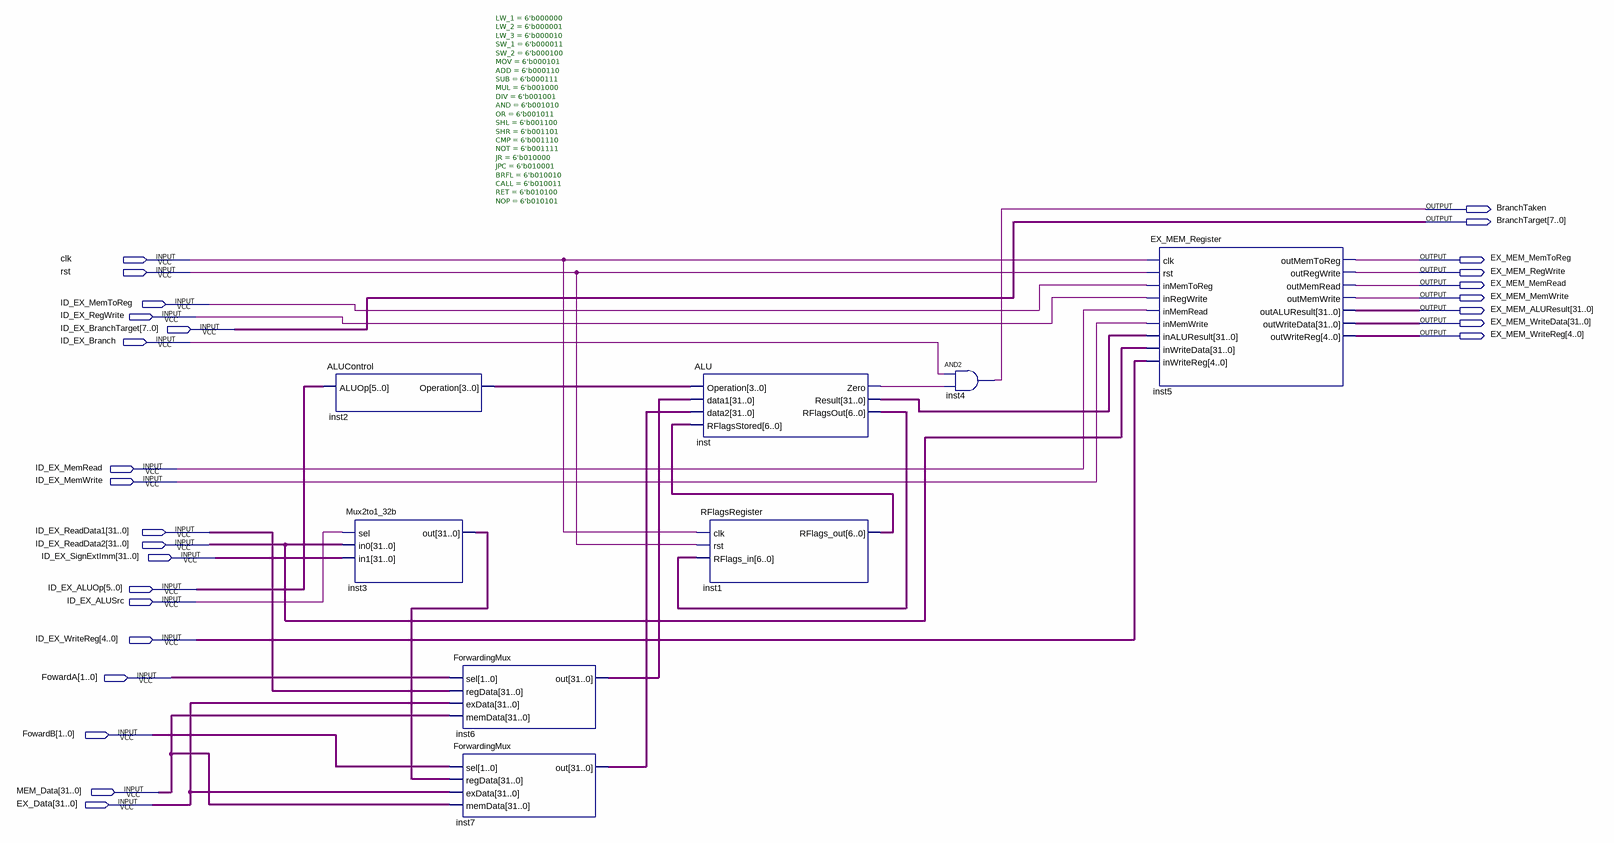
[diagram p0: schematic sheet]
// Quartus schematic EX_STAGE.bdf as structural Verilog: 8 symbols, 27 pins
module EX_STAGE (
  input  clk,
  input  rst,
  input  ID_EX_MemToReg,
  input  ID_EX_RegWrite,
  input  [7:0] ID_EX_BranchTarget,
  input  ID_EX_Branch,
  input  ID_EX_MemRead,
  input  ID_EX_MemWrite,
  input  [31:0] ID_EX_ReadData1,
  input  [31:0] ID_EX_ReadData2,
  input  [31:0] ID_EX_SignExtImm,
  input  [5:0] ID_EX_ALUOp,
  input  ID_EX_ALUSrc,
  input  [4:0] ID_EX_WriteReg,
  input  [1:0] FowardA,
  input  [1:0] FowardB,
  input  [31:0] MEM_Data,
  input  [31:0] EX_Data,
  output BranchTaken,
  output [7:0] BranchTarget,
  output EX_MEM_MemToReg,
  output EX_MEM_RegWrite,
  output EX_MEM_MemRead,
  output EX_MEM_MemWrite,
  output [31:0] EX_MEM_ALUResult,
  output [31:0] EX_MEM_WriteData,
  output [4:0] EX_MEM_WriteReg
);

  wire inst_zero;
  wire [3:0] inst2_operation;
  wire [6:0] inst1_rflags_out, inst_rflagsout;
  wire [31:0] inst3_out, inst6_out, inst7_out, inst_result;

  ALUControl #(.LW_1(6'b000000), .LW_2(6'b000001), .LW_3(6'b000010), .SW_1(6'b000011), .SW_2(6'b000100), .MOV(6'b000101), .ADD(6'b000110), .SUB(6'b000111), .MUL(6'b001000), .DIV(6'b001001), .AND(6'b001010), .OR(6'b001011), .SHL(6'b001100), .SHR(6'b001101), .CMP(6'b001110), .NOT(6'b001111), .JR(6'b010000), .JPC(6'b010001), .BRFL(6'b010010), .CALL(6'b010011), .RET(6'b010100), .NOP(6'b010101)) inst2 (
    .ALUOp(ID_EX_ALUOp), .Operation(inst2_operation));
  Mux2to1_32b inst3 (.sel(ID_EX_ALUSrc), .in0(ID_EX_ReadData2), .in1(ID_EX_SignExtImm), .out(inst3_out));
  ForwardingMux inst6 (.sel(FowardA), .regData(ID_EX_ReadData1), .exData(EX_Data), .memData(MEM_Data), .out(inst6_out));
  ForwardingMux inst7 (.sel(FowardB), .regData(inst3_out), .exData(EX_Data), .memData(MEM_Data), .out(inst7_out));
  ALU inst (
    .Operation(inst2_operation), .data1(inst6_out), .data2(inst7_out), .RFlagsStored(inst1_rflags_out),
    .Zero(inst_zero), .Result(inst_result), .RFlagsOut(inst_rflagsout));
  RFlagsRegister inst1 (.clk(clk), .rst(rst), .RFlags_in(inst_rflagsout), .RFlags_out(inst1_rflags_out));
  and inst4 (BranchTaken, ID_EX_Branch, inst_zero);
  EX_MEM_Register inst5 (
    .clk(clk), .rst(rst), .inMemToReg(ID_EX_MemToReg), .inRegWrite(ID_EX_RegWrite),
    .inMemRead(ID_EX_MemRead), .inMemWrite(ID_EX_MemWrite), .inALUResult(inst_result),
    .inWriteData(ID_EX_ReadData2), .inWriteReg(ID_EX_WriteReg), .outMemToReg(EX_MEM_MemToReg),
    .outRegWrite(EX_MEM_RegWrite), .outMemRead(EX_MEM_MemRead), .outMemWrite(EX_MEM_MemWrite),
    .outALUResult(EX_MEM_ALUResult), .outWriteData(EX_MEM_WriteData), .outWriteReg(EX_MEM_WriteReg));

  assign BranchTarget = ID_EX_BranchTarget;
endmodule
